# Altium project HAB-Altitude-Dynamics-Control-Card.PrjPcb (part 4 of 4)

## Sheet 12V-Power-Supplies.SchDoc: Payload Card 12V Rail Power Supplies
size A3; Organization: Brickworks; Address1: Matthew Glazer; Address2: Design Engineer; Revision: 1A; SheetNumber: 7; SheetTotal: 7
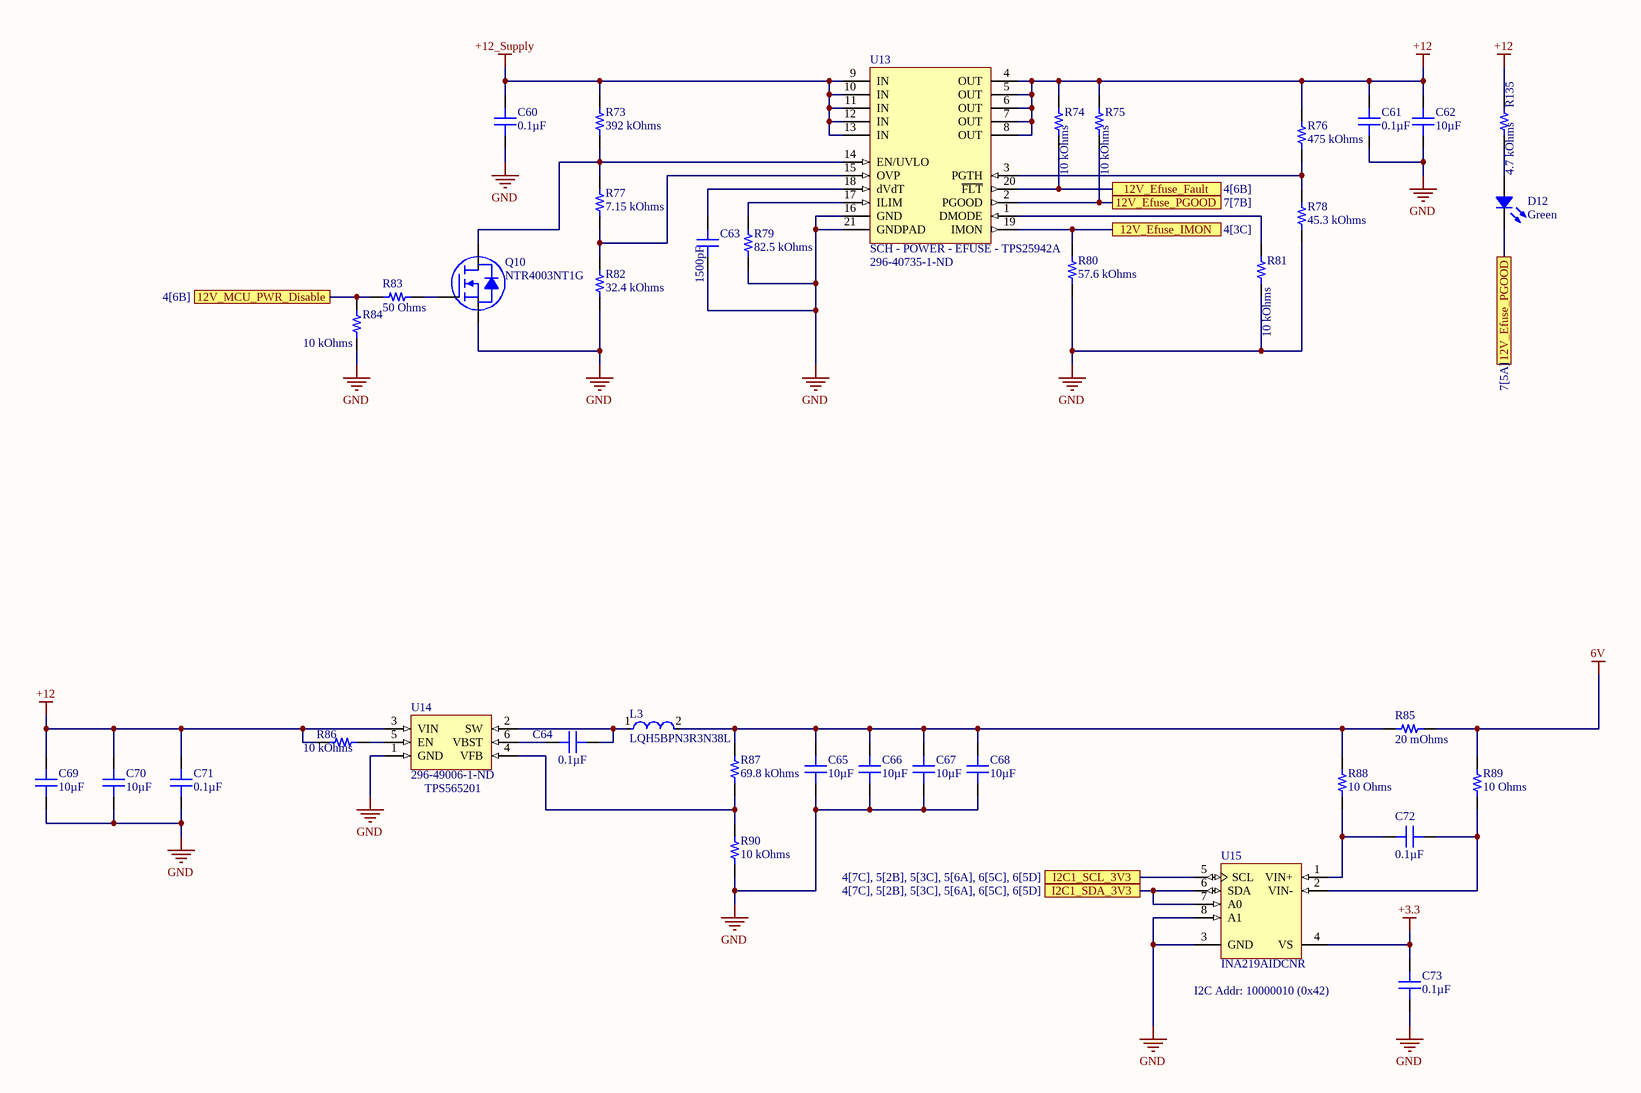
[diagram p6: 12V-Power-Supplies.SchDoc]

### Parts
C60  0.1µF  [CAP 0603_1608]
C61  0.1µF  [CAP 0603_1608]
C62  10µF  [CAP 0805_2012]
C63  1500pF  [CAP 0603_1608]
C64  0.1µF  [CAP 0603_1608]
C65  10µF  [CAP 0805_2012]
C66  10µF  [CAP 0805_2012]
C67  10µF  [CAP 0805_2012]
C68  10µF  [CAP 0805_2012]
C69  10µF  [CAP 0805_2012]
C70  10µF  [CAP 0805_2012]
C71  0.1µF  [CAP 0603_1608]
C72  0.1µF  [CAP 0603_1608]
C73  0.1µF  [CAP 0603_1608]
D12  Green  [LED 0603_1608 GREEN]
L3  LQH5BPN3R3N38L  [FP-LQH5BPN_38-MFG]
Q10  NTR4003NT1G  [ON SEMI SOT-23-3]
R73  392 kOhms  [RES 0603_1608]
R74  10 kOhms  [RES 0603_1608]
R75  10 kOhms  [RES 0603_1608]
R76  475 kOhms  [RES 0603_1608]
R77  7.15 kOhms  [RES 0603_1608]
R78  45.3 kOhms  [RES 0603_1608]
R79  82.5 kOhms  [RES 0603_1608]
R80  57.6 kOhms  [RES 0603_1608]
R81  10 kOhms  [RES 0603_1608]
R82  32.4 kOhms  [RES 0603_1608]
R83  50 Ohms  [RES 0603_1608]
R84  10 kOhms  [RES 0603_1608]
R85  20 mOhms  [RES 0805_2012]
R86  10 kOhms  [RES 0603_1608]
R87  69.8 kOhms  [RES 0603_1608]
R88  10 Ohms  [RES 0603_1608]
R89  10 Ohms  [RES 0603_1608]
R90  10 kOhms  [RES 0603_1608]
R135  4.7 kOhms  [RES 0603_1608]
U13  SCH - POWER - EFUSE - TPS25942A  Supplier Part Number 1: 296-40735-1-ND  [PCB - LEADLESS - QFN - TI 20-WQFN]
U14  Supplier Part Number 1: 296-49006-1-ND  [PCB - LEADS - SOT- TI TSOT-23-6]  (hidden comment: SCH - REGULATOR - BUCK - TI TPS565201DDCR)
U15  INA219AIDCNR  [DCN0008A_M]

### Ports
12V_Efuse_Fault (see 4[6B]), 12V_Efuse_IMON (see 4[3C]), 12V_Efuse_PGOOD (see 7[5A]), 12V_Efuse_PGOOD (see 7[7B]), 12V_MCU_PWR_Disable (see 4[6B]), I2C1_SCL_3V3 (see 4[7C], 5[2B], 5[3C], 5[6A], 6[5C], 6[5D]), I2C1_SDA_3V3 (see 4[7C], 5[2B], 5[3C], 5[6A], 6[5C], 6[5D])

### Nets
6V: R85.2 R89.2
+3.3: C73.2 U15.4(VS)
+12: C61.2 C62.2 C69.2 C70.2 C71.1 R74.2 R75.2 R76.2 R86.1 R135.2 U13.4(OUT) U13.5(OUT) U13.6(OUT) U13.7(OUT) U13.8(OUT) U14.3(VIN)
+12_Supply: C60.2 R73.2 U13.9(IN) U13.10(IN) U13.11(IN) U13.12(IN) U13.13(IN)
GND: C60.1 C61.1 C62.1 C63.1 C65.1 C66.1 C67.1 C68.1 C69.1 C70.1 C71.2 C73.1 Q10.2(S) R78.1 R79.1 R80.1 R81.1 R82.1 R84.1 R90.1 U13.16(GND) U13.21(GNDPAD) U14.1(GND) U15.3(GND) U15.8(A1)
NetC63_2: C63.2 U13.18(dVdT)
NetC64_1: C64.1 L3.1 U14.2(SW)
NetC64_2: C64.2 U14.6(VBST)
NetC65_2: C65.2 C66.2 C67.2 C68.2 L3.2 R85.1 R87.2 R88.2
NetC72_1: C72.1 R89.1 U15.2(VIN-)
NetC72_2: C72.2 R88.1 U15.1(VIN+)
NetD12_1: D12.1 R135.1
NetD12_2: D12.2 R75.1 U13.2(PGOOD) ; port 12V_Efuse_PGOOD
NetQ10_1: Q10.1(G) R83.1
NetQ10_3: Q10.3(D) R73.1 R77.2 U13.14(EN/UVLO)
NetR29_1: U15.5(SCL) ; port I2C1_SCL_3V3
NetR30_1: U15.6(SDA) U15.7(A0) ; port I2C1_SDA_3V3
NetR74_1: R74.1 U13.20(~{FLT}) ; port 12V_Efuse_Fault
NetR76_1: R76.1 R78.2 U13.3(PGTH)
NetR77_1: R77.1 R82.2 U13.15(OVP)
NetR79_2: R79.2 U13.17(ILIM)
NetR80_2: R80.2 U13.19(IMON) ; port 12V_Efuse_IMON
NetR81_2: R81.2 U13.1(DMODE)
NetR83_2: R83.2 R84.2 ; port 12V_MCU_PWR_Disable
NetR86_2: R86.2 U14.5(EN)
NetR87_1: R87.1 R90.2 U14.4(VFB)

### Notes on the sheet
- (near U14) TPS565201
- I2C Addr: 10000010 (0x42)
- Title
- Size:
- Date:
- A3
- Number:
- Time:
- Revision:
- Sheet
- of
- File:

### Library data of the parts
C60 C61 C64 C71-C73 = CL10B104KA8WPNC: CAP CER 0.1UF 25V X7R 0603; Manufacturer: Samsung Electro-Mechanics; Tolerance: ±10%; Part Number: CL10B104KA8WPNC; Value: 0.1µF; Applications: Automotive; Capacitance: 0.1µF; ComponentLink1Description: Datasheet; ComponentLink1URL: http://www.samsungsem.com/kr/support/product-search/mlcc/CL10B104KA8WPNC.jsp; ComponentLink2Description: DigiKey Link; ComponentLink2URL: http://digikey.com/product-detail/en/samsung-electro-mechanics/CL10B104KA8WPNC/1276-6717-1-ND/5961576; Device Package: 0603 (1608 Metric); Features: Open Mode; LastUpdated: 9/2/2020 1:03:30 AM; Lifecycle Status: Active; Minimum Order: 1; Mounting Type: Surface Mount, MLCC; Operating Temperature: -55°C ~ 125°C; Package / Case: 0603 (1608 Metric); Packaging: TapeAndReel; PartId: 5631; Part Status: Active; Price: 0.02; Ratings: AEC-Q200; Series: CL; Size / Dimension: 0.063" L x 0.031" W (1.60mm x 0.80mm); Supplier 1: DigiKey; Supplier Part Number 1: 1276-6717-1-ND; Temperature Coefficient: X7R; Thickness (Max): 0.035" (0.90mm); Voltage - Rated: 25V
C62 C65-C70 = CC0805KKX5R7BB106: CAP CER 10UF 16V X5R 0805; Manufacturer: Yageo; Tolerance: ±10%; Part Number: CC0805KKX5R7BB106; Value: 10µF; Applications: General Purpose; Capacitance: 10µF; ComponentLink1Description: Datasheet; ComponentLink1URL: https://www.yageo.com/upload/media/product/productsearch/datasheet/mlcc/UPY-GPHC_X5R_4V-to-50V_25.pdf; ComponentLink2Description: DigiKey Link; ComponentLink2URL: http://digikey.com/product-detail/en/yageo/CC0805KKX5R7BB106/311-1865-1-ND/5195767; Device Package: 0805 (2012 Metric); LastUpdated: 9/2/2020 1:04:30 AM; Lifecycle Status: Active; Minimum Order: 1; Mounting Type: Surface Mount, MLCC; Operating Temperature: -55°C ~ 85°C; Package / Case: 0805 (2012 Metric); Packaging: TapeAndReel; PartId: 8867; Part Status: Active; Price: 0.09; Series: CC; Size / Dimension: 0.079" L x 0.049" W (2.00mm x 1.25mm); Supplier 1: DigiKey; Supplier Part Number 1: 311-1865-1-ND; Temperature Coefficient: X5R; Thickness (Max): 0.057" (1.45mm); Voltage - Rated: 16V
C63 = CC0603JRX7R8BB152: CAP CER 1500PF 25V X7R 0603; Manufacturer: Yageo; Tolerance: ±5%; Part Number: CC0603JRX7R8BB152; Value: 1500pF; Applications: General Purpose; Capacitance: 1500pF; ComponentLink1Description: Datasheet; ComponentLink1URL: https://www.yageo.com/upload/media/product/productsearch/datasheet/mlcc/UPY-GPHC_X7R_6.3V-to-50V_18.pdf; ComponentLink2Description: DigiKey Link; ComponentLink2URL: http://digikey.com/product-detail/en/yageo/CC0603JRX7R8BB152/311-3996-1-ND/8025085; Device Package: 0603 (1608 Metric); LastUpdated: 9/2/2020 1:03:18 AM; Lifecycle Status: Active; Minimum Order: 1; Mounting Type: Surface Mount, MLCC; Operating Temperature: -55°C ~ 125°C; Package / Case: 0603 (1608 Metric); Packaging: TapeAndReel; PartId: 12307; Part Status: Active; Price: 0.02; Series: CC; Size / Dimension: 0.063" L x 0.031" W (1.60mm x 0.80mm); Supplier 1: DigiKey; Supplier Part Number 1: 311-3996-1-ND; Temperature Coefficient: X7R; Thickness (Max): 0.035" (0.90mm); Voltage - Rated: 25V
D12 = LTST-C193KGKT-5A: LED GREEN CLEAR CHIP SMD; Manufacturer: Lite-On Inc.; Configuration: Standard; Current - Test: 5mA; Lens Color: Colorless; Lens Size: 1.15mm x 0.80mm; Lens Style: Rectangle with Flat Top; Millicandela Rating: 16.25mcd; Viewing Angle: 130°; Voltage - Forward (Vf) (Typ): 2V; Wavelength - Dominant: 572nm; Wavelength - Peak: 574nm; Part Number: LTST-C193KGKT-5A; Color: Green; ComponentLink1Description: Datasheet; ComponentLink1URL: http://optoelectronics.liteon.com/upload/download/DS22-2007-0094/LTST-C193KGKT-5A.PDF; ComponentLink2Description: DigiKey Link; ComponentLink2URL: http://digikey.com/product-detail/en/lite-on-inc/LTST-C193KGKT-5A/160-1828-1-ND/2356247; Device Package: 0603 (1608 Metric); Height (Max): 0.45mm; LastUpdated: 9/2/2020 1:20:41 AM; Lens Transparency: Clear; Lifecycle Status: Active; Minimum Order: 1; Mounting Type: Surface Mount; Package / Case: 0603 (1608 Metric); Packaging: TapeAndReel; PartId: 694; Part Status: Active; Price: 0.06; Series: -; Size / Dimension: 1.60mm L x 0.80mm W; Supplier 1: DigiKey; Supplier Part Number 1: 160-1828-1-ND; Supplier Device Package: Chip LED; Value: Green
L3 = CMP-06042-003208-1: Wire Wound Ferrite Inductor for Power Lines 3.3μH ±30% 0.0252Ω 4000mA 2020; Saturation Current: 4A; DC Resistance (DCR): 21mR; Test Frequency: 100kHz; Shielding: Shielded; Inductance: 3.3uH; Self Resonant Frequency: 25MHz; Core Material: Ferrite; Current Rating: 4A; Mount: Surface Mount; Resistor Type: Wirewound; Case/Package: Nonstandard; Tolerance: 30%; Max Operating Temperature: 85°C; Packaging: Cut Tape; Min Operating Temperature: -40°C
Q10 = NTR4003NT1G: MOSFET N-CH 30V 500MA SOT-23; Manufacturer: ON Semiconductor; Current - Continuous Drain (Id) @ 25°C: 500mA (Ta); Drive Voltage (Max Rds On,  Min Rds On): 2.5V, 4V; FET Type: N-Channel; Gate Charge (Qg) (Max) @ Vgs: 1.15nC @ 5V; Input Capacitance (Ciss) (Max) @ Vds: 21pF @ 5V; Power Dissipation (Max): 690mW (Ta); Rds On (Max) @ Id, Vgs: 1.5Ohm @ 10mA, 4V; Vgs (Max): ±20V; Vgs(th) (Max) @ Id: 1.4V @ 250µA; Part Number: NTR4003NT1G; ComponentLink1Description: Datasheet; ComponentLink1URL: http://www.onsemi.com/pub/Collateral/NTR4003N-D.PDF; ComponentLink2Description: DigiKey Link; ComponentLink2URL: http://digikey.com/product-detail/en/on-semiconductor/NTR4003NT1G/NTR4003NT1GOSCT-ND/1967270; Drain to Source Voltage (Vdss): 30V; LastUpdated: 9/2/2020 1:25:08 AM; Lifecycle Status: Active; Minimum Order: 1; Mounting Type: Surface Mount; Operating Temperature: -55°C ~ 150°C (TJ); Package / Case: TO-236-3, SC-59, SOT-23-3; Packaging: TapeAndReel; Part Status: Active; Price: 0.05; Series: -; Supplier 1: DigiKey; Supplier Part Number 1: NTR4003NT1GOSCT-ND; Supplier Device Package: SOT-23-3 (TO-236); Technology: MOSFET (Metal Oxide)
R73 = RMCF0603FT392K: RES 392K OHM 1% 1/10W 0603; Manufacturer: Stackpole Electronics Inc; Power (Watts): 0.1W, 1/10W; Temperature Coefficient: ±100ppm/°C; Part Number: RMCF0603FT392K; Value: 392 kOhms; ComponentLink1Description: Datasheet; ComponentLink1URL: https://www.seielect.com/catalog/sei-rmcf_rmcp.pdf; ComponentLink2Description: DigiKey Link; ComponentLink2URL: http://digikey.com/product-detail/en/stackpole-electronics-inc/RMCF0603FT392K/RMCF0603FT392KCT-ND/1943135; Composition: Thick Film; Device Package: 0603 (1608 Metric); Features: Automotive AEC-Q200; Height - Seated (Max): 0.022" (0.55mm); LastUpdated: 9/2/2020 1:10:02 AM; Lifecycle Status: Active; Minimum Order: 1; Number of Terminations: 2; Operating Temperature: -55°C ~ 155°C; Package / Case: 0603 (1608 Metric); Packaging: CutTape; PartId: 15680; Part Status: Active; Price: 0.10; Ratings: AEC-Q200; Resistance: 392 kOhms; Series: RMCF; Size / Dimension: 0.061" L x 0.031" W (1.55mm x 0.80mm); Supplier 1: DigiKey; Supplier Part Number 1: RMCF0603FT392KCT-ND; Supplier Device Package: 0603; Tolerance: ±1%
R74 R75 R81 R84 R86 = RMCF0603JT10K0: RES 10K OHM 5% 1/10W 0603; Manufacturer: Stackpole Electronics Inc; Power (Watts): 0.1W, 1/10W; Temperature Coefficient: ±200ppm/°C; Part Number: RMCF0603JT10K0; Value: 10 kOhms; ComponentLink1Description: Datasheet; ComponentLink1URL: https://www.seielect.com/catalog/sei-packaging.pdf; ComponentLink2Description: DigiKey Link; ComponentLink2URL: http://digikey.com/product-detail/en/stackpole-electronics-inc/RMCF0603JT10K0/RMCF0603JT10K0CT-ND/1943191; Composition: Thick Film; Device Package: 0603 (1608 Metric); Features: Automotive AEC-Q200; Height - Seated (Max): 0.022" (0.55mm); LastUpdated: 8/30/2020 8:48:45 PM; Lifecycle Status: Active; Minimum Order: 1; Number of Terminations: 2; Operating Temperature: -55°C ~ 155°C; Package / Case: 0603 (1608 Metric); Packaging: CutTape; PartId: 25659; Part Status: Active; Price: 0.10; Ratings: AEC-Q200; Resistance: 10 kOhms; Series: RMCF; Size / Dimension: 0.061" L x 0.031" W (1.55mm x 0.80mm); Supplier 1: DigiKey; Supplier Part Number 1: RMCF0603JT10K0CT-ND; Supplier Device Package: 0603; Tolerance: ±5%
R76 = RMCF0603FT475K: RES 475K OHM 1% 1/10W 0603; Manufacturer: Stackpole Electronics Inc; Power (Watts): 0.1W, 1/10W; Temperature Coefficient: ±100ppm/°C; Part Number: RMCF0603FT475K; Value: 475 kOhms; ComponentLink1Description: Datasheet; ComponentLink1URL: https://www.seielect.com/catalog/sei-rmcf_rmcp.pdf; ComponentLink2Description: DigiKey Link; ComponentLink2URL: http://digikey.com/product-detail/en/stackpole-electronics-inc/RMCF0603FT475K/RMCF0603FT475KCT-ND/1943137; Composition: Thick Film; Device Package: 0603 (1608 Metric); Features: Automotive AEC-Q200; Height - Seated (Max): 0.022" (0.55mm); LastUpdated: 9/2/2020 1:10:13 AM; Lifecycle Status: Active; Minimum Order: 1; Number of Terminations: 2; Operating Temperature: -55°C ~ 155°C; Package / Case: 0603 (1608 Metric); Packaging: CutTape; PartId: 10682; Part Status: Active; Price: 0.10; Ratings: AEC-Q200; Resistance: 475 kOhms; Series: RMCF; Size / Dimension: 0.061" L x 0.031" W (1.55mm x 0.80mm); Supplier 1: DigiKey; Supplier Part Number 1: RMCF0603FT475KCT-ND; Supplier Device Package: 0603; Tolerance: ±1%
R77 = ERJ-PB3B7151V: RES SMD 7.15K OHM 0.1% 1/5W 0603; Manufacturer: Panasonic Electronic Components; Power (Watts): 0.2W, 1/5W; Temperature Coefficient: ±50ppm/°C; Part Number: ERJ-PB3B7151V; Value: 7.15 kOhms; ComponentLink1Description: Datasheet; ComponentLink1URL: https://industrial.panasonic.com/cdbs/www-data/pdf/RDM0000/AOA0000C328.pdf; ComponentLink2Description: DigiKey Link; ComponentLink2URL: http://digikey.com/product-detail/en/panasonic-electronic-components/ERJ-PB3B7151V/P20070CT-ND/6214325; Composition: Thick Film; Device Package: 0603 (1608 Metric); Features: Automotive AEC-Q200, Pulse Withstanding; Height - Seated (Max): 0.022" (0.55mm); LastUpdated: 9/2/2020 1:10:22 AM; Lifecycle Status: Active; Minimum Order: 1; Number of Terminations: 2; Operating Temperature: -55°C ~ 155°C; Package / Case: 0603 (1608 Metric); Packaging: TapeAndReel; PartId: 6380; Part Status: Active; Price: 0.03; Ratings: AEC-Q200; Resistance: 7.15 kOhms; Series: ERJ; Size / Dimension: 0.063" L x 0.031" W (1.60mm x 0.80mm); Supplier 1: DigiKey; Supplier Part Number 1: P20070CT-ND; Supplier Device Package: 0603; Tolerance: ±0.1%
R78 = RMCF0603FT45K3: RES 45.3K OHM 1% 1/10W 0603; Manufacturer: Stackpole Electronics Inc; Power (Watts): 0.1W, 1/10W; Temperature Coefficient: ±100ppm/°C; Part Number: RMCF0603FT45K3; Value: 45.3 kOhms; ComponentLink1Description: Datasheet; ComponentLink1URL: https://www.seielect.com/catalog/sei-rmcf_rmcp.pdf; ComponentLink2Description: DigiKey Link; ComponentLink2URL: http://digikey.com/product-detail/en/stackpole-electronics-inc/RMCF0603FT45K3/RMCF0603FT45K3CT-ND/4425109; Composition: Thick Film; Device Package: 0603 (1608 Metric); Features: Automotive AEC-Q200; Height - Seated (Max): 0.022" (0.55mm); LastUpdated: 9/2/2020 1:10:13 AM; Lifecycle Status: Active; Minimum Order: 1; Number of Terminations: 2; Operating Temperature: -55°C ~ 155°C; Package / Case: 0603 (1608 Metric); Packaging: CutTape; PartId: 10832; Part Status: Active; Price: 0.10; Ratings: AEC-Q200; Resistance: 45.3 kOhms; Series: RMCF; Size / Dimension: 0.061" L x 0.031" W (1.55mm x 0.80mm); Supplier 1: DigiKey; Supplier Part Number 1: RMCF0603FT45K3CT-ND; Supplier Device Package: 0603; Tolerance: ±1%
R79 = RMCF0603FT82K5: RES 82.5K OHM 1% 1/10W 0603; Manufacturer: Stackpole Electronics Inc; Power (Watts): 0.1W, 1/10W; Temperature Coefficient: ±100ppm/°C; Part Number: RMCF0603FT82K5; Value: 82.5 kOhms; ComponentLink1Description: Datasheet; ComponentLink1URL: https://www.seielect.com/catalog/sei-rmcf_rmcp.pdf; ComponentLink2Description: DigiKey Link; ComponentLink2URL: http://digikey.com/product-detail/en/stackpole-electronics-inc/RMCF0603FT82K5/RMCF0603FT82K5CT-ND/1943114; Composition: Thick Film; Device Package: 0603 (1608 Metric); Features: Automotive AEC-Q200; Height - Seated (Max): 0.022" (0.55mm); LastUpdated: 9/2/2020 1:10:21 AM; Lifecycle Status: Active; Minimum Order: 1; Number of Terminations: 2; Operating Temperature: -55°C ~ 155°C; Package / Case: 0603 (1608 Metric); Packaging: CutTape; PartId: 6620; Part Status: Active; Price: 0.10; Ratings: AEC-Q200; Resistance: 82.5 kOhms; Series: RMCF; Size / Dimension: 0.061" L x 0.031" W (1.55mm x 0.80mm); Supplier 1: DigiKey; Supplier Part Number 1: RMCF0603FT82K5CT-ND; Supplier Device Package: 0603; Tolerance: ±1%
R80 = RMCF0603FT57K6: RES 57.6K OHM 1% 1/10W 0603; Manufacturer: Stackpole Electronics Inc; Power (Watts): 0.1W, 1/10W; Temperature Coefficient: ±100ppm/°C; Part Number: RMCF0603FT57K6; Value: 57.6 kOhms; ComponentLink1Description: Datasheet; ComponentLink1URL: https://www.seielect.com/catalog/sei-packaging.pdf; ComponentLink2Description: DigiKey Link; ComponentLink2URL: http://digikey.com/product-detail/en/stackpole-electronics-inc/RMCF0603FT57K6/RMCF0603FT57K6CT-ND/4376682; Composition: Thick Film; Device Package: 0603 (1608 Metric); Features: Automotive AEC-Q200; Height - Seated (Max): 0.022" (0.55mm); LastUpdated: 9/2/2020 1:10:00 AM; Lifecycle Status: Active; Minimum Order: 1; Number of Terminations: 2; Operating Temperature: -55°C ~ 155°C; Package / Case: 0603 (1608 Metric); Packaging: CutTape; PartId: 16337; Part Status: Active; Price: 0.10; Ratings: AEC-Q200; Resistance: 57.6 kOhms; Series: RMCF; Size / Dimension: 0.061" L x 0.031" W (1.55mm x 0.80mm); Supplier 1: DigiKey; Supplier Part Number 1: RMCF0603FT57K6CT-ND; Supplier Device Package: 0603; Tolerance: ±1%
R82 = ERJ-PB3B3242V: RES SMD 32.4K OHM 0.1% 1/5W 0603; Manufacturer: Panasonic Electronic Components; Power (Watts): 0.2W, 1/5W; Temperature Coefficient: ±50ppm/°C; Part Number: ERJ-PB3B3242V; Value: 32.4 kOhms; ComponentLink1Description: Datasheet; ComponentLink1URL: https://industrial.panasonic.com/cdbs/www-data/pdf/RDM0000/AOA0000C328.pdf; ComponentLink2Description: DigiKey Link; ComponentLink2URL: http://digikey.com/product-detail/en/panasonic-electronic-components/ERJ-PB3B3242V/P20142CT-ND/6214397; Composition: Thick Film; Device Package: 0603 (1608 Metric); Features: Automotive AEC-Q200, Pulse Withstanding; Height - Seated (Max): 0.022" (0.55mm); LastUpdated: 9/2/2020 1:10:06 AM; Lifecycle Status: Active; Minimum Order: 1; Number of Terminations: 2; Operating Temperature: -55°C ~ 155°C; Package / Case: 0603 (1608 Metric); Packaging: TapeAndReel; PartId: 13586; Part Status: Active; Price: 0.03; Ratings: AEC-Q200; Resistance: 32.4 kOhms; Series: ERJ; Size / Dimension: 0.063" L x 0.031" W (1.60mm x 0.80mm); Supplier 1: DigiKey; Supplier Part Number 1: P20142CT-ND; Supplier Device Package: 0603; Tolerance: ±0.1%
R83 = CRCW060350R0FKEA: RES SMD 50 OHM 1% 1/10W 0603; Manufacturer: Vishay Dale; Power (Watts): 0.1W, 1/10W; Temperature Coefficient: ±100ppm/°C; Part Number: CRCW060350R0FKEA; Value: 50 Ohms; ComponentLink1Description: Datasheet; ComponentLink1URL: http://www.vishay.com/docs/20035/dcrcwe3.pdf; ComponentLink2Description: DigiKey Link; ComponentLink2URL: http://digikey.com/product-detail/en/vishay-dale/CRCW060350R0FKEA/541-3318-1-ND/6684924; Composition: Thick Film; Device Package: 0603 (1608 Metric); Features: Automotive AEC-Q200; Height - Seated (Max): 0.020" (0.50mm); LastUpdated: 9/2/2020 1:09:40 AM; Lifecycle Status: Active; Minimum Order: 1; Number of Terminations: 2; Operating Temperature: -55°C ~ 155°C; Package / Case: 0603 (1608 Metric); Packaging: CutTape; PartId: 23780; Part Status: Active; Price: 0.10; Ratings: AEC-Q200; Resistance: 50 Ohms; Series: CRCW; Size / Dimension: 0.061" L x 0.033" W (1.55mm x 0.85mm); Supplier 1: DigiKey; Supplier Part Number 1: 541-3318-1-ND; Supplier Device Package: 0603; Tolerance: ±1%
R85 = ERJ-6CWDR020V: 0805 CURRENT SENSING RES. 0.5%,; Manufacturer: Panasonic Electronic Components; Power (Watts): 0.5W, 1/2W; Temperature Coefficient: ±75ppm/°C; Part Number: ERJ-6CWDR020V; Value: 20 mOhms; ComponentLink1Description: Datasheet; ComponentLink1URL: https://industrial.panasonic.com/cdbs/www-data/pdf/RDN0000/AOA0000C313.pdf; ComponentLink2Description: DigiKey Link; ComponentLink2URL: http://digikey.com/product-detail/en/panasonic-electronic-components/ERJ-6CWDR020V/P124408CT-ND/10261713; Composition: Thick Film; Device Package: 0805 (2012 Metric); Features: Automotive AEC-Q200, Current Sense; Height - Seated (Max): 0.030" (0.75mm); LastUpdated: 9/2/2020 1:14:37 AM; Lifecycle Status: Active; Minimum Order: 1; Number of Terminations: 2; Operating Temperature: -55°C ~ 125°C; Package / Case: 0805 (2012 Metric); Packaging: TapeAndReel; PartId: 47494; Part Status: Active; Price: 0.14; Ratings: AEC-Q200; Resistance: 20 mOhms; Series: ERJ; Size / Dimension: 0.081" L x 0.051" W (2.05mm x 1.30mm); Supplier 1: DigiKey; Supplier Part Number 1: P124408CT-ND; Supplier Device Package: 0805; Tolerance: ±0.5%
R87 = RMCF0603FT69K8: RES 69.8K OHM 1% 1/10W 0603; Manufacturer: Stackpole Electronics Inc; Power (Watts): 0.1W, 1/10W; Temperature Coefficient: ±100ppm/°C; Part Number: RMCF0603FT69K8; Value: 69.8 kOhms; ComponentLink1Description: Datasheet; ComponentLink1URL: https://www.seielect.com/catalog/sei-rmcf_rmcp.pdf; ComponentLink2Description: DigiKey Link; ComponentLink2URL: http://digikey.com/product-detail/en/stackpole-electronics-inc/RMCF0603FT69K8/RMCF0603FT69K8CT-ND/2418123; Composition: Thick Film; Device Package: 0603 (1608 Metric); Features: Automotive AEC-Q200; Height - Seated (Max): 0.022" (0.55mm); LastUpdated: 9/2/2020 1:10:00 AM; Lifecycle Status: Active; Minimum Order: 1; Number of Terminations: 2; Operating Temperature: -55°C ~ 155°C; Package / Case: 0603 (1608 Metric); Packaging: CutTape; PartId: 16385; Part Status: Active; Price: 0.10; Ratings: AEC-Q200; Resistance: 69.8 kOhms; Series: RMCF; Size / Dimension: 0.061" L x 0.031" W (1.55mm x 0.80mm); Supplier 1: DigiKey; Supplier Part Number 1: RMCF0603FT69K8CT-ND; Supplier Device Package: 0603; Tolerance: ±1%
R88 R89 = CRGCQ0603F10R: CRGCQ 0603 10R 1%; Manufacturer: TE Connectivity Passive Product; Power (Watts): 0.1W, 1/10W; Temperature Coefficient: ±400ppm/°C; Part Number: CRGCQ0603F10R; Value: 10 Ohms; ComponentLink1Description: Datasheet; ComponentLink1URL: https://www.te.com/commerce/DocumentDelivery/DDEController?Action=srchrtrv&DocNm=1773204-3&DocType=DS&DocLang=English; ComponentLink2Description: DigiKey Link; ComponentLink2URL: http://digikey.com/product-detail/en/te-connectivity-passive-product/CRGCQ0603F10R/A129664CT-ND/8577496; Composition: Thick Film; Device Package: 0603 (1608 Metric); Features: Automotive AEC-Q200, Moisture Resistant; Height - Seated (Max): 0.022" (0.55mm); LastUpdated: 9/2/2020 1:09:39 AM; Lifecycle Status: Active; Minimum Order: 1; Number of Terminations: 2; Operating Temperature: -55°C ~ 155°C; Package / Case: 0603 (1608 Metric); Packaging: CutTape; PartId: 23975; Part Status: Active; Price: 0.10; Ratings: AEC-Q200; Resistance: 10 Ohms; Series: CRGCQ; Size / Dimension: 0.063" L x 0.031" W (1.60mm x 0.80mm); Supplier 1: DigiKey; Supplier Part Number 1: A129664CT-ND; Supplier Device Package: 0603; Tolerance: ±1%
R90 = RMCF0603FT10K0: RES 10K OHM 1% 1/10W 0603; Manufacturer: Stackpole Electronics Inc; Power (Watts): 0.1W, 1/10W; Temperature Coefficient: ±100ppm/°C; Part Number: RMCF0603FT10K0; Value: 10 kOhms; ComponentLink1Description: Datasheet; ComponentLink1URL: https://www.seielect.com/catalog/sei-rmcf_rmcp.pdf; ComponentLink2Description: DigiKey Link; ComponentLink2URL: http://digikey.com/product-detail/en/stackpole-electronics-inc/RMCF0603FT10K0/RMCF0603FT10K0CT-ND/1943057; Composition: Thick Film; Device Package: 0603 (1608 Metric); Features: Automotive AEC-Q200; Height - Seated (Max): 0.022" (0.55mm); LastUpdated: 9/2/2020 1:09:31 AM; Lifecycle Status: Active; Minimum Order: 1; Number of Terminations: 2; Operating Temperature: -55°C ~ 155°C; Package / Case: 0603 (1608 Metric); Packaging: CutTape; PartId: 25663; Part Status: Active; Price: 0.10; Ratings: AEC-Q200; Resistance: 10 kOhms; Series: RMCF; Size / Dimension: 0.061" L x 0.031" W (1.55mm x 0.80mm); Supplier 1: DigiKey; Supplier Part Number 1: RMCF0603FT10K0CT-ND; Supplier Device Package: 0603; Tolerance: ±1%
R135 = RMCF0603FT4K70: RES 4.7K OHM 1% 1/10W 0603; Manufacturer: Stackpole Electronics Inc; Power (Watts): 0.1W, 1/10W; Temperature Coefficient: ±100ppm/°C; Part Number: RMCF0603FT4K70; Value: 4.7 kOhms; ComponentLink1Description: Datasheet; ComponentLink1URL: https://www.seielect.com/catalog/sei-rmcf_rmcp.pdf; ComponentLink2Description: DigiKey Link; ComponentLink2URL: http://digikey.com/product-detail/en/stackpole-electronics-inc/RMCF0603FT4K70/RMCF0603FT4K70CT-ND/1943033; Composition: Thick Film; Device Package: 0603 (1608 Metric); Features: Automotive AEC-Q200; Height - Seated (Max): 0.022" (0.55mm); LastUpdated: 9/2/2020 1:10:22 AM; Lifecycle Status: Active; Minimum Order: 1; Number of Terminations: 2; Operating Temperature: -55°C ~ 155°C; Package / Case: 0603 (1608 Metric); Packaging: CutTape; PartId: 6078; Part Status: Active; Price: 0.10; Ratings: AEC-Q200; Resistance: 4.7 kOhms; Series: RMCF; Size / Dimension: 0.061" L x 0.031" W (1.55mm x 0.80mm); Supplier 1: DigiKey; Supplier Part Number 1: RMCF0603FT4K70CT-ND; Supplier Device Package: 0603; Tolerance: ±1%
U15 = CMP-0704-00041-2: Zero-Drift, Bi-directional Current / Power Monitor, 3 to 5.5 V, -40 to 125 degC, 8-pin SOP (DCN8), Green (RoHS & no Sb/Br); Manufacturer: Texas Instruments; Input Offset (+/-)(Max)(uV): 100; Small-Signal Bandwidth(Typ)(MHz): 0.011; SubFamily: Current Shunt Monitor; Rating: Catalog; Quiescent Current (+/-)(Typ)(mA): 0.7; Vs(Max)(V): 5.5; Common Mode Range(Min)(V): 0; Vs(Min)(V): 3; Common Mode Range(Max)(V): 26; Gain(V/V): 1, 0.5, 0.25, 0.125; ComponentLink3URL: http://www.ti.com/lit/ml/mpds099c/mpds099c.pdf; ComponentLink2URL: http://www.ti.com/general/docs/lit/getliterature.tsp?genericPartNumber=INA219&fileType=pdf; PackageReference: DCN0008A; ComponentLink1URL: http://www.ti.com/; ComponentLink1Description: Manufacturer URL; Code_JEDEC: MO-178; CMRR(Min)(dB): 100; DatasheetVersion: SBOS448F; Mounting Technology: Surface Mount; ComponentLink3Description: Package Specification; PartNumber: INA219AIDCNR; PackageVersion: 4202106/D, 11/2009; Eco-Plan: Green (RoHS & no Sb/Br); ComponentLink2Description: Datasheet; PackageDescription: 8-Pin Plastic Small Outline, Body 1.6 x 2.9 mm, Pitch 0.65 mm
U13 = SCH - POWER - EFUSE - TPS25942A: Supplier 1: Digi-Key
U14 = SCH - REGULATOR - BUCK - TI TPS565201DDCR: Supplier 1: Digi-Key

## Nets that join several sheets
6V: Controllers (Q1.3 Q5.3 R1.2 R16.2), 12V-Power-Supplies (R85.2 R89.2)
+1.8: Interfaces (C9.2 C16.2 J8.5 J11.5), Sensors (13 pins), Power-Supplies (R50.2 R53.2)
+3.3: Interfaces (5 pins), Transceivers (16 pins), Microcontroller (25 pins), Sensors (14 pins), Power-Supplies (7 pins), 12V-Power-Supplies (C73.2 U15.4)
+5: Transceivers (C75.2 U16.3), Controllers (Q2.3 R6.2), Power-Supplies (23 pins)
+5_Supply: Interfaces (C4.2 C5.2 J1.5 J1.6), Power-Supplies (7 pins)
+12_Supply: Interfaces (C2.2 C3.2 J1.1 J1.2), 12V-Power-Supplies (7 pins)
GND: Interfaces (31 pins), Transceivers (28 pins), Controllers (13 pins), Microcontroller (30 pins), Sensors (34 pins), Power-Supplies (46 pins), 12V-Power-Supplies (25 pins)
ETH_RX_N: Interfaces (J1.28 R27.1), Transceivers (U17.4)
ETH_RX_P: Interfaces (J1.27 R26.1), Transceivers (U17.5)
ETH_TX_N: Interfaces (J1.26 R25.1), Transceivers (U17.6)
ETH_TX_P: Interfaces (J1.25 R24.1), Transceivers (U17.7)
NetC1_2: Interfaces (C1.2 J3.3), Controllers (Q1.2 R31.2)
NetC6_2: Interfaces (C6.2 J4.3), Controllers (Q5.2 R126.2)
NetC8_2: Interfaces (C8.2 J5.2 J6.2), Controllers (Q2.2 R125.2)
NetD1_1: Interfaces (R127.2), Power-Supplies (D1.1)
NetD3_1: Microcontroller (U1.82), Power-Supplies (D3.1)
NetD4_1: Interfaces (J1.10), Transceivers (D4.1 U16.6)
NetD4_2: Interfaces (J1.9), Transceivers (D4.2 U16.7)
NetJ1_14: Interfaces (J1.14), Microcontroller (U1.81)
NetJ1_15: Interfaces (J1.15), Microcontroller (U1.80)
NetJ1_16: Interfaces (J1.16), Microcontroller (U1.79)
NetJ3_2: Interfaces (J3.2), Microcontroller (U1.63)
NetJ4_2: Interfaces (J4.2), Microcontroller (U1.64)
NetJ5_1: Interfaces (J5.1), Controllers (Q6.3)
NetJ6_1: Interfaces (J6.1), Controllers (Q8.3 TP11.1)
NetJ7_1: Interfaces (J7.1), Sensors (U8.9 U8.12)
NetJ7_2: Interfaces (J7.2), Sensors (U8.8)
NetJ7_3: Interfaces (J7.3), Sensors (U8.7)
NetJ8_2: Interfaces (J8.2), Microcontroller (U1.37)
NetJ8_3: Interfaces (J8.3 J11.3), Microcontroller (R129.1 U1.66)
NetJ8_4: Interfaces (J8.4 J11.4), Microcontroller (R130.1 U1.67)
NetJ11_2: Interfaces (J11.2), Microcontroller (U1.38)
NetR12_2: Controllers (R12.2 R14.2), Microcontroller (U1.43)
NetR13_2: Controllers (R13.2 R15.2), Microcontroller (U1.39)
NetR18_2: Controllers (R18.2 R19.2), Microcontroller (U1.42)
NetR20_2: Controllers (R20.2 R21.2), Microcontroller (U1.41)
NetR22_2: Controllers (R22.2 R23.2), Microcontroller (U1.40)
NetR29_1: Microcontroller (R29.1 U1.92), Sensors (U9.1 U11.6 U18.10), Power-Supplies (U5.5 U7.5), 12V-Power-Supplies (U15.5)
NetR30_1: Microcontroller (R30.1 U1.93), Sensors (U9.6 U11.5 U18.9), Power-Supplies (U5.6 U7.6), 12V-Power-Supplies (U15.6 U15.7)
NetR37_1: Microcontroller (U1.60), Power-Supplies (R37.1 U2.20)
NetR44_2: Microcontroller (U1.29), Power-Supplies (R44.2 U2.19)
NetR57_2: Microcontroller (U1.4), Sensors (R57.2)
NetR74_1: Microcontroller (U1.58), 12V-Power-Supplies (R74.1 U13.20)
NetR80_2: Microcontroller (U1.30), 12V-Power-Supplies (R80.2 U13.19)
NetR83_2: Microcontroller (U1.59), 12V-Power-Supplies (R83.2 R84.2)
NetR91_2: Transceivers (R91.2), Microcontroller (U1.78)
NetR94_1: Transceivers (R94.1 U17.11), Microcontroller (U1.25)
NetR98_1: Transceivers (R98.1), Microcontroller (U1.18)
NetR99_1: Transceivers (U17.24), Microcontroller (R99.1)
NetR100_1: Transceivers (U17.25), Microcontroller (R100.1)
NetR101_1: Transceivers (U17.26), Microcontroller (R101.1)
NetR102_1: Transceivers (U17.27), Microcontroller (R102.1)
NetR103_1: Transceivers (R103.1), Microcontroller (U1.48)
NetR104_1: Transceivers (R104.1 R116.2), Microcontroller (U1.24)
NetR105_1: Transceivers (R105.1 R117.2), Microcontroller (U1.33)
NetR106_1: Transceivers (R106.1 R118.2), Microcontroller (U1.34)
NetR107_1: Transceivers (R107.1 R119.2), Microcontroller (U1.35)
NetR108_1: Transceivers (R108.1 R120.2), Microcontroller (U1.36)
NetR111_1: Transceivers (R111.1 R121.2), Microcontroller (U1.47)
NetR112_1: Transceivers (R112.1 R122.2), Microcontroller (U1.32)
NetR114_1: Transceivers (R114.1 R123.2), Microcontroller (U1.23)
NetR115_1: Transceivers (R115.1 R124.2), Microcontroller (U1.26)
NetU1_16: Transceivers (U17.12), Microcontroller (U1.16)
NetU1_44: Microcontroller (U1.44), Sensors (U12.7)
NetU1_45: Microcontroller (U1.45), Sensors (U9.3)
NetU1_46: Microcontroller (U1.46), Sensors (U10.12)
NetU1_55: Microcontroller (U1.55), Sensors (U8.14)
NetU1_56: Microcontroller (U1.56), Sensors (U8.15)
NetU1_57: Microcontroller (U1.57), Sensors (U8.16)
NetU1_70: Transceivers (U16.4), Microcontroller (U1.70)
NetU1_71: Transceivers (U16.1), Microcontroller (U1.71)
USB_HEADER_N: Interfaces (J2.2 U3.1), Microcontroller (U1.53)
USB_HEADER_P: Interfaces (J2.3 U3.2), Microcontroller (U1.54)